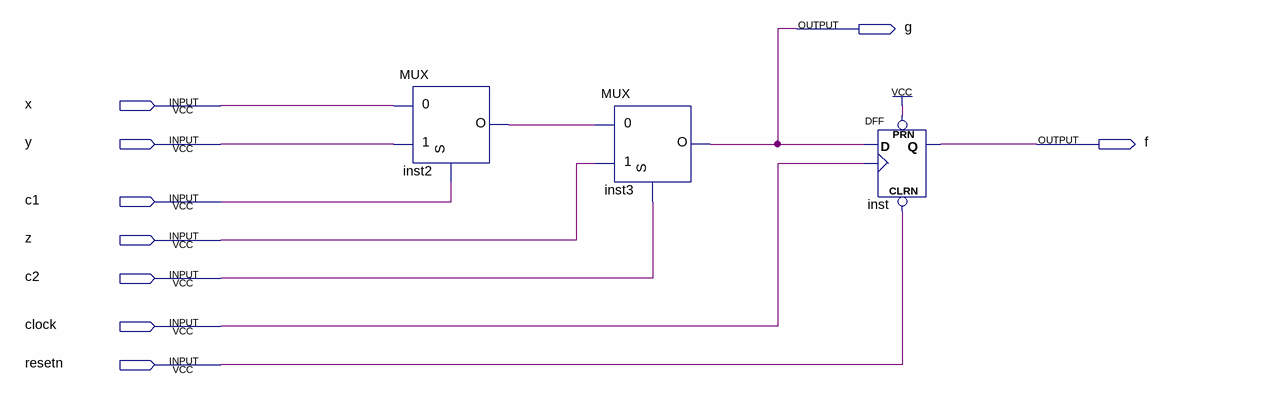
[diagram p0: schematic sheet]
// Quartus schematic Q3.bdf as structural Verilog: 3 symbols, 9 pins
module Q3 (
  input  x,
  input  y,
  input  c1,
  input  z,
  input  c2,
  input  clock,
  input  resetn,
  output g,
  output f
);

  wire inst2_o;

  MUX inst2 (.\0 (x), .\1 (y), .S(c1), .O(inst2_o));
  MUX inst3 (.\0 (inst2_o), .\1 (z), .S(c2), .O(g));
  DFF inst (.CLRN(resetn), .CLK(clock), .D(g), .PRN(1'b1), .Q(f));
endmodule
